# Altium schematic sheet Power_Sheet.SchDoc
size A
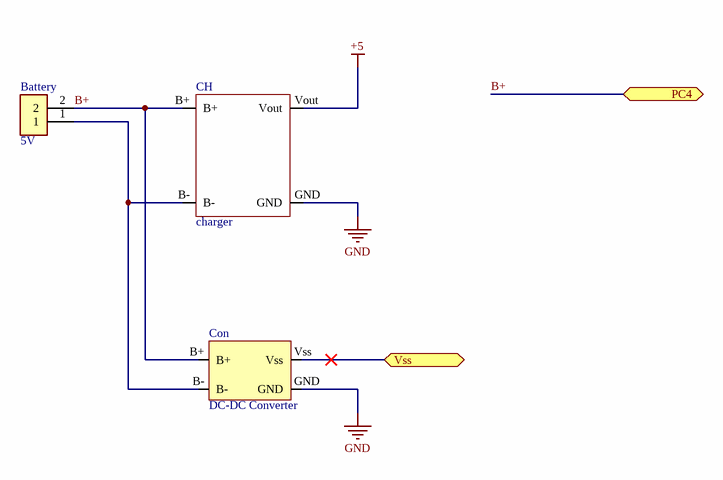
[diagram p0: Power_Sheet.SchDoc]

## Parts
Battery  5V  [JST_B2B-PH-K-S(LF)(SN)]
CH  charger  [1S_Charger]
Con  DC-DC Converter  [DC-DC Conv]

## Ports
PC4 (bidir), Vss (bidir)

## Nets
+5: CH.Vout
GND: CH.GND Con.GND
B+: Battery.2 CH.B+ Con.B+ ; port PC4
Vss: Con.Vss ; port Vss
NetBattery_1: Battery.1 CH.B- Con.B-

## Library data of the parts
Battery = B2B-PH-K-S(LF)(SN): Connector Header Through Hole 2 position 0.079 _2.00mm_; MF: JST Sales; MP: B2B-PH-K-S_LF__SN_; Package: None; Value: *; Price: None; Availability: Unavailable; SnapEDA_Link: https://www.snapeda.com/parts/B2B-PH-K-S%28LF%29%28SN%29/JST%20Sales%20America%20Inc./view-part/424103/?ref=snap
Con = DC-DC Converter: pin to pad: GND>Vout- Vss>Vout+